# EAGLE design Enclosure 85x58 BHC (EAGLE 9.6.2)
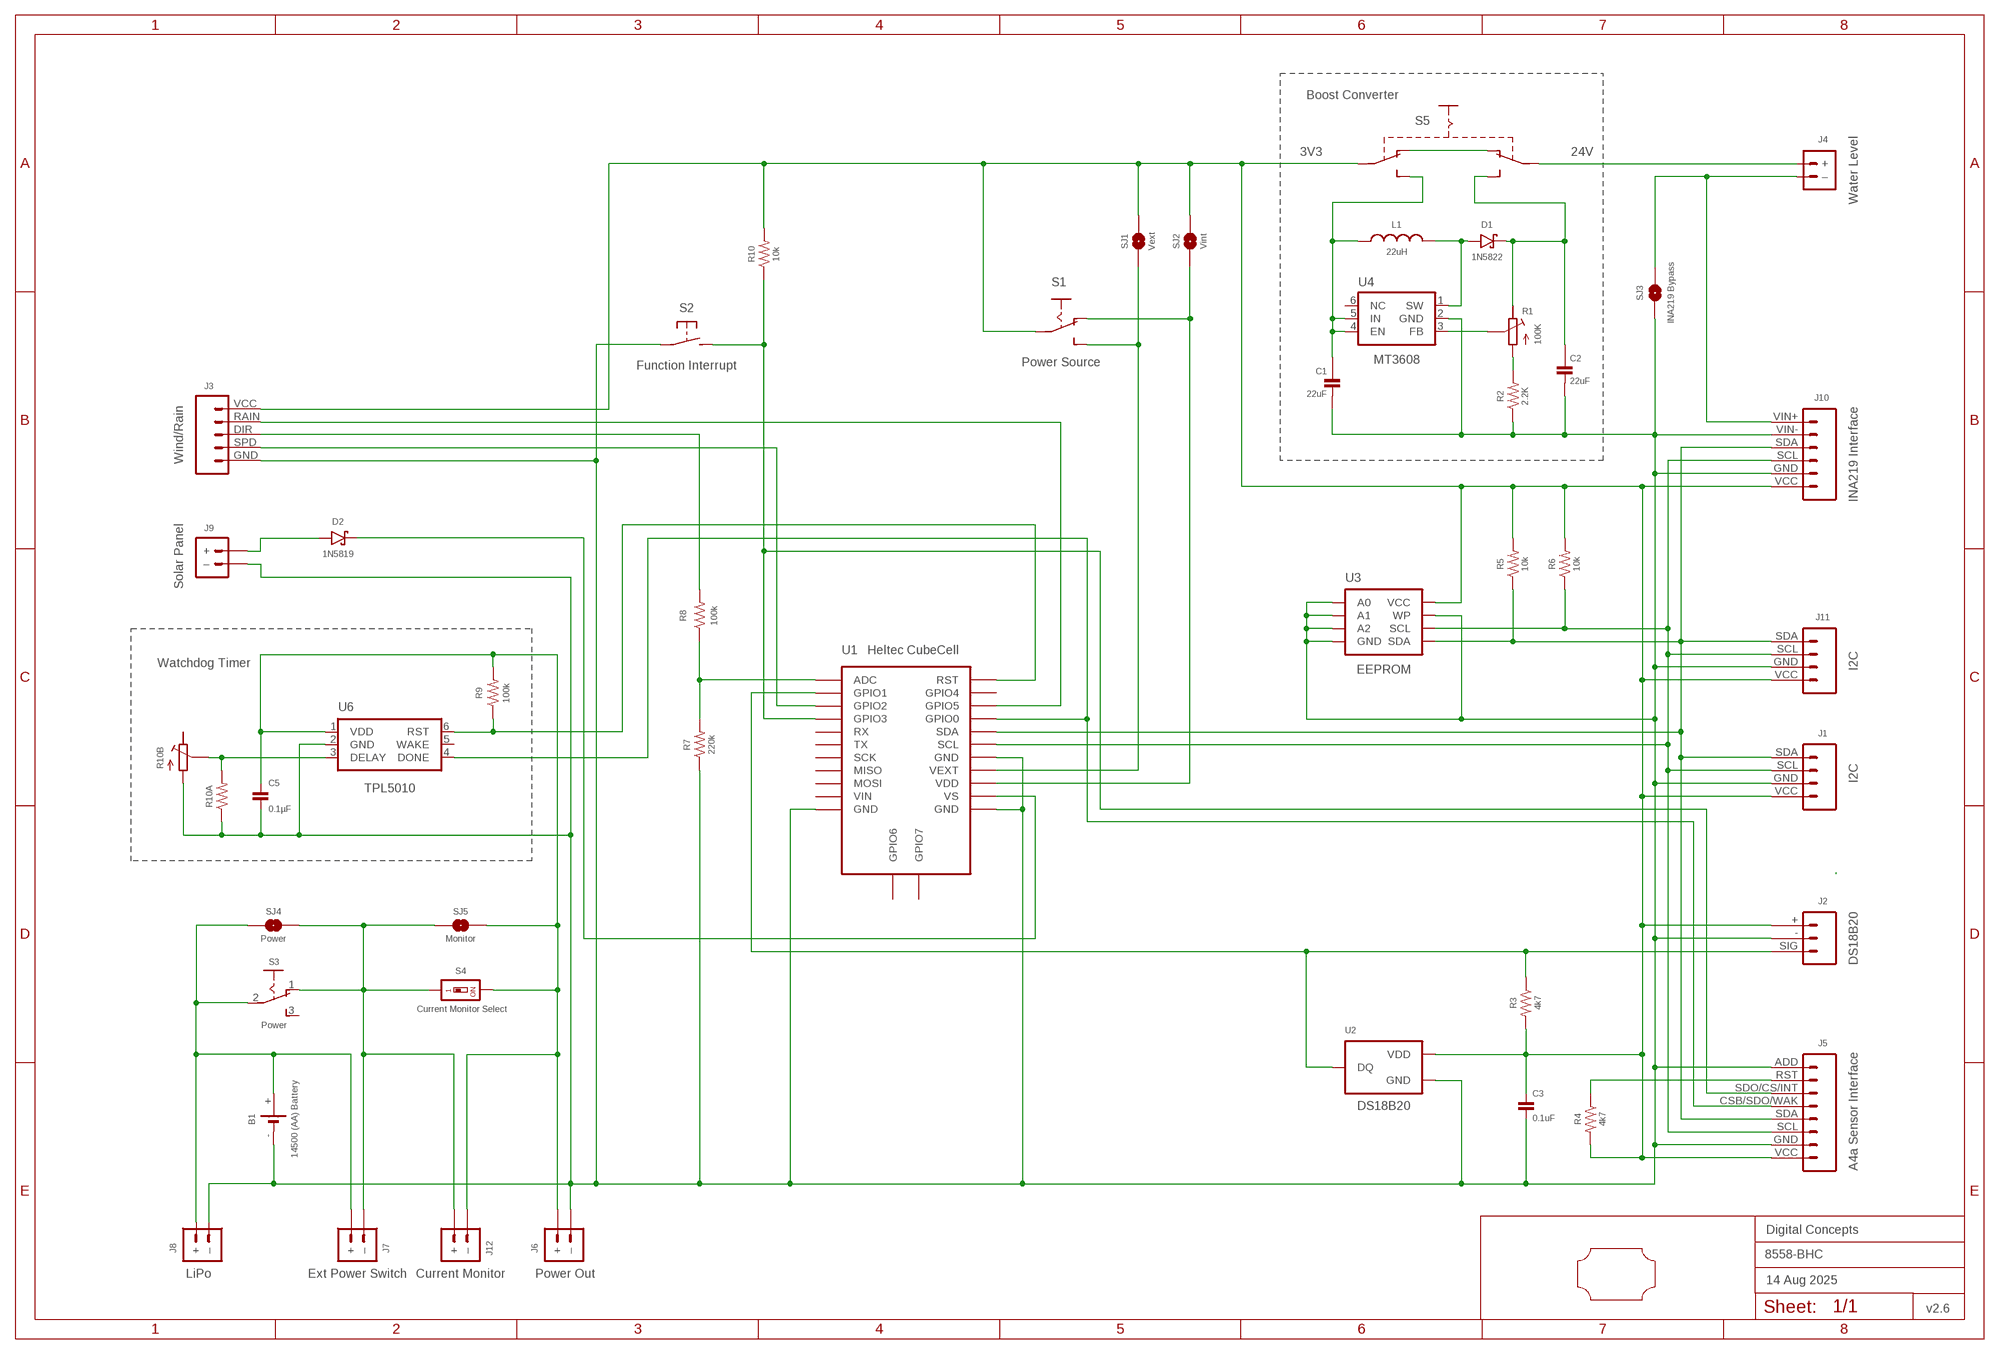
[diagram p0: schematic, sheet 1]
FRAME2 (A3L-LOC): DATE: 14 Aug 2025; OWNER: Digital Concepts; TITLE: 8558-BHC; VERSION: v2.6

## Parts
B1  14500 (AA) Battery  BATTERY-HOLDER-14500(AA)  [BATTERY-14500]
C1  22uF  CAPACITOR-1206  [C1206]
C2  22uF  CAPACITOR-1206  [C1206]
C3  0.1uF  CAPACITOR-0805  [C0805]
C5  0.1µF  CAPACITOR-0805  [C0805]
D1  1N5822  DIODE-SCHOTTKY-1N5822  [DIODE_SMB]
D2  1N5819  1N5819-SOD-123  [SOD-123]
J1  I2C  JST-PH2.0-4-VERTICAL-I2C  [JST-PH2.0-4-VERTICAL-I2C]
J2  DS18B20  JST-PH2.0-3-VERTICAL-DS18B20  [JST-PH2.0-3-VERTICAL]
J3  Wind/Rain  JST-PH2.0-5-VERTICAL-WEATHER  [JST-PH2.0-5-WEATHER]
J4  Water Level  JST-PH2.0-2-VERTICAL  [JST-PH2.0-2-VERTICAL=POWER]
J5  A4a Sensor Interface  HEADER-1X8-SENSOR  [CONN_08-SENSOR]
J6  Power Out  JST-GH1.25-2-HORIZONTAL-POWER  [JST-GH1.25-2-HORIZONTAL]
J7  Ext Power Switch  JST-PH2.0-2-DUAL-POWERJST-PTH-2  [JST-PH2.0-2-DUAL-POWER]
J8  LiPo  JST-PH2.0-2-MALE-HORIZONTALJST-PTH-2  [JST-PH2.0-2-HORIZONTAL]
J9  Solar Panel  JST-PH2.0-2-DUAL-POWERJST-PTH-2  [JST-PH2.0-2-DUAL-POWER]
J10  INA219 Interface  INA219-I2C-MODULE  [CONN_06-INA219]
J11  I2C  JST-PH2.0-4-HORIZONTAL-I2C  [JST-PH2.0-4-HORIZONTAL-I2C]
J12  Current Monitor  JST-PH2.0-2-HORIZONTAL-POWERJST-PTH-2  [JST-PH2.0-2-HORIZONTAL-POWER]
L1  22uH  INDUCTOR-CDRH104R/6D28L5038P  [CDRH104R+6D28]
R1  100K  RESISTOR-TRIMM-BAOTER-HORIZONTAL  [RTRIM64P]
R2  2.2K  RESISTORR0805  [R0805]
R3  4k7  RESISTORR0805  [R0805]
R4  4k7  RESISTORR0805  [R0805]
R5  10k  RESISTORR0805  [R0805]
R6  10k  RESISTORR0805  [R0805]
R7  220k  RESISTORR0805  [R0805]
R8  100k  RESISTORR0805  [R0805]
R9  100k  RESISTORR0805  [R0805]
R10  10k  RESISTORR0805  [R0805]
R10A  RESISTORR0805  [R0805]
R10B  RESISTOR-TRIMM-33  [RTRIM3*3]
S1  Power Source  SWITCH-SLIDE-SPDT-SMT  [SWITCH-SPDT-SMT]
S2  Function Interrupt  SWITCH-MOMENTARY-2-PIN  [SWITCH-2-PAD]
S3  Power  SWITCH-SLIDE-SPDT  [SWITCH-SLIDE-SPDT]
S4  Current Monitor Select  SWITCH-DIP-SWS001  [SMD-001]
S5  SWITCH-SLIDE-DPDT-PTH-S  [SWITCH-DPDT-PTH]
SJ1  Vext  SJ  [SJ]
SJ2  Vint  SJ-V-1  [SJ-VIA-1]
SJ3  INA219 Bypass  SJ  [SJ]
SJ4  Power  SJ  [SJ]
SJ5  Monitor  SJ  [SJ]
U1  Heltec CubeCell  HELTEC-CUBECELL  [HELTEC-CUBECELL]
U2  DS18B20  THERMOMETER-DS18B20  [TO-92]
U3  EEPROM  AT24CXX-EEPROM  [SOP-8]
U4  MT3608  [SOT-23-6@1]
U6  TPL5010  TPL5010DDCR  [SOT-23-6]
U$1  PCB-OUTLINE-C-85X58  [PROTO-28X18-OUTLINE-C]

## Nets
GND: B1.- C1.2 C2.2 C3.2 C5.2 J1.GND J2.- J3.GND J5.ADD J5.GND J6.-(–) J8.-(–) J9.-(–) J10.GND J10.VIN- J11.GND R2.1 R7.1 R10A.1 R10B.1(A) S2.P$1(P) SJ3.1 U1.GND@11(GND) U1.GND@14(GND) U1.GND@18(GND) U2.1(GND) U3.P$1(A0) U3.P$2(A1) U3.P$3(A2) U3.P$4(GND) U3.P$7(WP) U4.2(GND) U6.2(GND)
N$1: D2.A J9.+
N$2: J3.DIR R8.2
N$4: B1.+ J7.+ J8.+ S3.2(P) SJ4.2
N$5: D2.C U1.VS
N$6: D1.A L1.1 U4.1(SW)
N$7: S1.P$1(O) SJ2.2 U1.VDD
N$8: J1.SCL J5.SCL J10.SCL J11.SCL R6.1 U1.SCL U3.P$6(SCL)
N$9: J5.RST R4.1
N$10: R7.2 R8.1 U1.ADC
N$11: J1.SDA J5.SDA J10.SDA J11.SDA R5.1 U1.SDA U3.P$5(SDA)
N$12: J3.SPD U1.GPIO2
N$14: C5.1 J6.+ J12.-(–) R9.2 S4.2 SJ5.1 U6.1(VDD)
N$15: J4.-(–) J10.VIN+ SJ3.2
N$18: J2.SIG R3.1 U1.GPIO1 U2.2(DQ)
N$19: J5.SDO/CS/INT R10.1 S2.P$2(S) U1.GPIO3
N$20: C2.1 D1.C R1.3(E) S5.P$3(S1)
N$21: S1.P$2(S) SJ1.2 U1.VEXT
N$22: J3.RAIN U1.GPIO5
N$23: R1.1(A) R2.2
N$24: R1.2(S) U4.3(FB)
N$25: C1.1 L1.2 S5.P$6(S2) U4.4(EN) U4.5(IN)
N$26: S5.P$1(O1) S5.P$4(O2)
N$27: J4.+ S5.P$2(P1)
N$28: J5.CSB/SDO/WAK U1.GPIO0 U6.4(DONE)
N$36: R10A.2 R10B.2(S) U6.3(DELAY)
N$37: R9.1 U1.RST U6.6(RST)
N$39: J7.-(–) J12.+ S3.1(O) S4.1 SJ4.1 SJ5.2
VCC: C3.1 J1.VCC J2.+ J3.VCC J5.VCC J10.VCC J11.VCC R3.2 R4.2 R5.2 R6.2 R10.2 S1.COMMON(P) S5.P$5(P2) SJ1.1 SJ2.1 SJ2.1@V U2.3(VDD) U3.P$8(VCC)
Unconnected: R10B.3(E) S3.3(S) U1.GPIO4 U1.GPIO6 U1.GPIO7 U1.MISO U1.MOSI U1.RX U1.SCK U1.TX U1.VIN U4.6(NC) U6.5(WAKE)

## Notes on the sheet
- Boost Converter
- 3V3 | 24V
- Watchdog Timer

## Library data of the parts
B1 = digitalconcepts:BATTERY-HOLDER-14500(AA): 14500 (AA) battery holder
C1 C2 = digitalconcepts:CAPACITOR-1206: 1206 Capacitor
C3 C5 = digitalconcepts:CAPACITOR-0805: 0805 Capacitor
D1 = digitalconcepts:DIODE-SCHOTTKY-1N5822: 1N5822 Schottky Diode SMB
D2 = digitalconcepts:1N5819-SOD-123: 1N5819 Schottky Diode SOD-123
J1 = digitalconcepts:JST-PH2.0-4-VERTICAL-I2C: PH2.0 4P I2C Vertical Connector
J2 = digitalconcepts:JST-PH2.0-3-VERTICAL-DS18B20: DS18B20 PH2.0 Vertical PCB Connector
J3 = digitalconcepts:JST-PH2.0-5-VERTICAL-WEATHER: PH2.0 5P Vertical Weather Connector
J4 = digitalconcepts:JST-PH2.0-2-VERTICAL: PH2.0 2P PCB Connector
J5 = digitalconcepts:HEADER-1X8-SENSOR: IoT Sensors 1x8 Pin Header for 'Sandwich' IoT Sensors
J6 = digitalconcepts:JST-GH1.25-2-HORIZONTAL-POWER: JST GH1.25 2P PTH Connector (Power)
J7 J9 = digitalconcepts:JST-PH2.0-2-DUAL-POWER: JST PH2.0 2P PTH Dual-Side Connector (Power); PROD_ID: CONN-09863; SKU: PRT-09914
J8 = digitalconcepts:JST-PH2.0-2-MALE-HORIZONTAL: PH2.0 2P Right Angle PCB Connector; PROD_ID: CONN-09863; SKU: PRT-09914
J10 = digitalconcepts:INA219-I2C-MODULE: INA219 I2C Module
J11 = digitalconcepts:JST-PH2.0-4-HORIZONTAL-I2C: PH2.0 4P I2C Horizontal Connector
J12 = digitalconcepts:JST-PH2.0-2-HORIZONTAL-POWER: PH2.0 2P Right Angle PCB Connector; PROD_ID: CONN-09863; SKU: PRT-09914
L1 = digitalconcepts:INDUCTOR-CDRH104R/6D28: Inductor; SPICEPREFIX: L
R1 = digitalconcepts:RESISTOR-TRIMM-BAOTER-HORIZONTAL: Trimm Resistor - Horizontal BAOTER
R2-R10 R10A = digitalconcepts:RESISTOR: Resistor; SPICEPREFIX: R
R10B = digitalconcepts:RESISTOR-TRIMM-3*3: Trimm Resistor - 3*3 SMD
S1 = digitalconcepts:SWITCH-SLIDE-SPDT-SMT: Mini Sliding Switch SPDT SMT
S2 = digitalconcepts:SWITCH-MOMENTARY-2-PIN: 2 Pin Momentary Switch
S3 = digitalconcepts:SWITCH-SLIDE-SPDT: Mini Sliding Switch SPDT
S4 = digitalconcepts:SWITCH-DIP-SWS001: SMD Dip Switch 1 pol.
S5 = digitalconcepts:SWITCH-SLIDE-DPDT-PTH-S: Switch DPDT PTH-S
SJ1 SJ3-SJ5 = digitalconcepts:SJ: Solder Jumper
SJ2 = digitalconcepts:SJ-V-1: Solder Jumper with single Pad Via
U1 = digitalconcepts:HELTEC-CUBECELL: Heltec CubeCell Development Board
U2 = digitalconcepts:THERMOMETER-DS18B20: Digital Thermometer -55C-125C TO92-3; AVAILABILITY: Bad; DESCRIPTION: Temperature Sensor Digital, Local -55°C ~ 125°C 12 b 8-uMAX; MF: Maxim Integrated; MP: DS18B20; PACKAGE: TO-92 Maxim Integrated; PRICE: None
U3 = digitalconcepts:AT24CXX-EEPROM: AT24Cxx EEPROM SOP-8
U4 = digitalconcepts:MT3608: MT3608 DC-DC Step-Up Voltage Converter
U6 = digitalconcepts:TPL5010DDCR: TPL5010 Nano-Power System Timer with Watchdog
U$1 = digitalconcepts:PCB-OUTLINE-C-85X58: PCB outline with cut-out for 85 x 58 enclosure

## Board
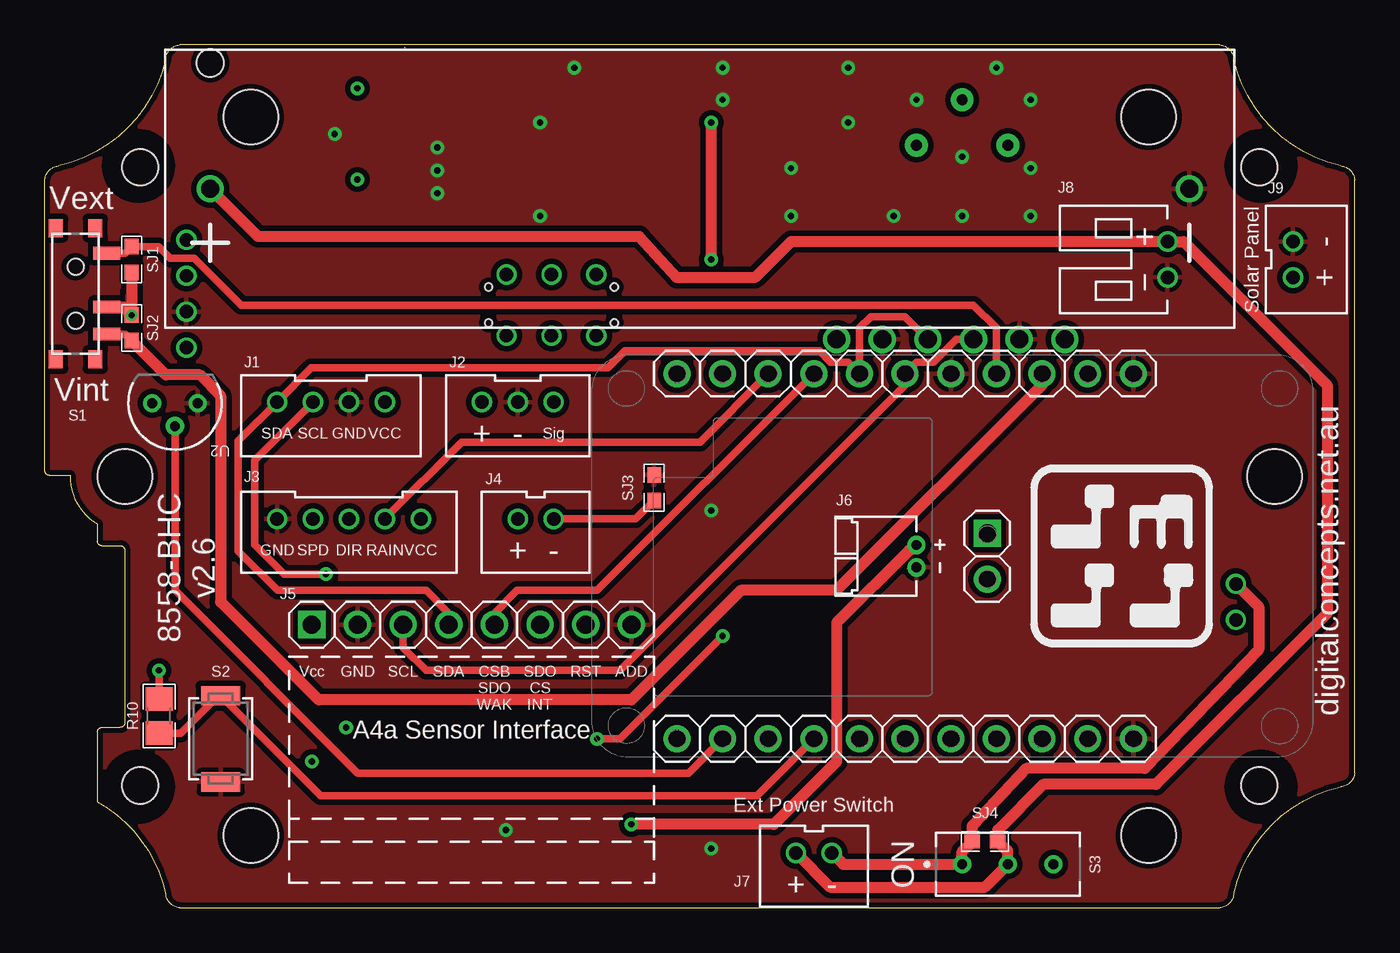
[diagram p1: board, top side]
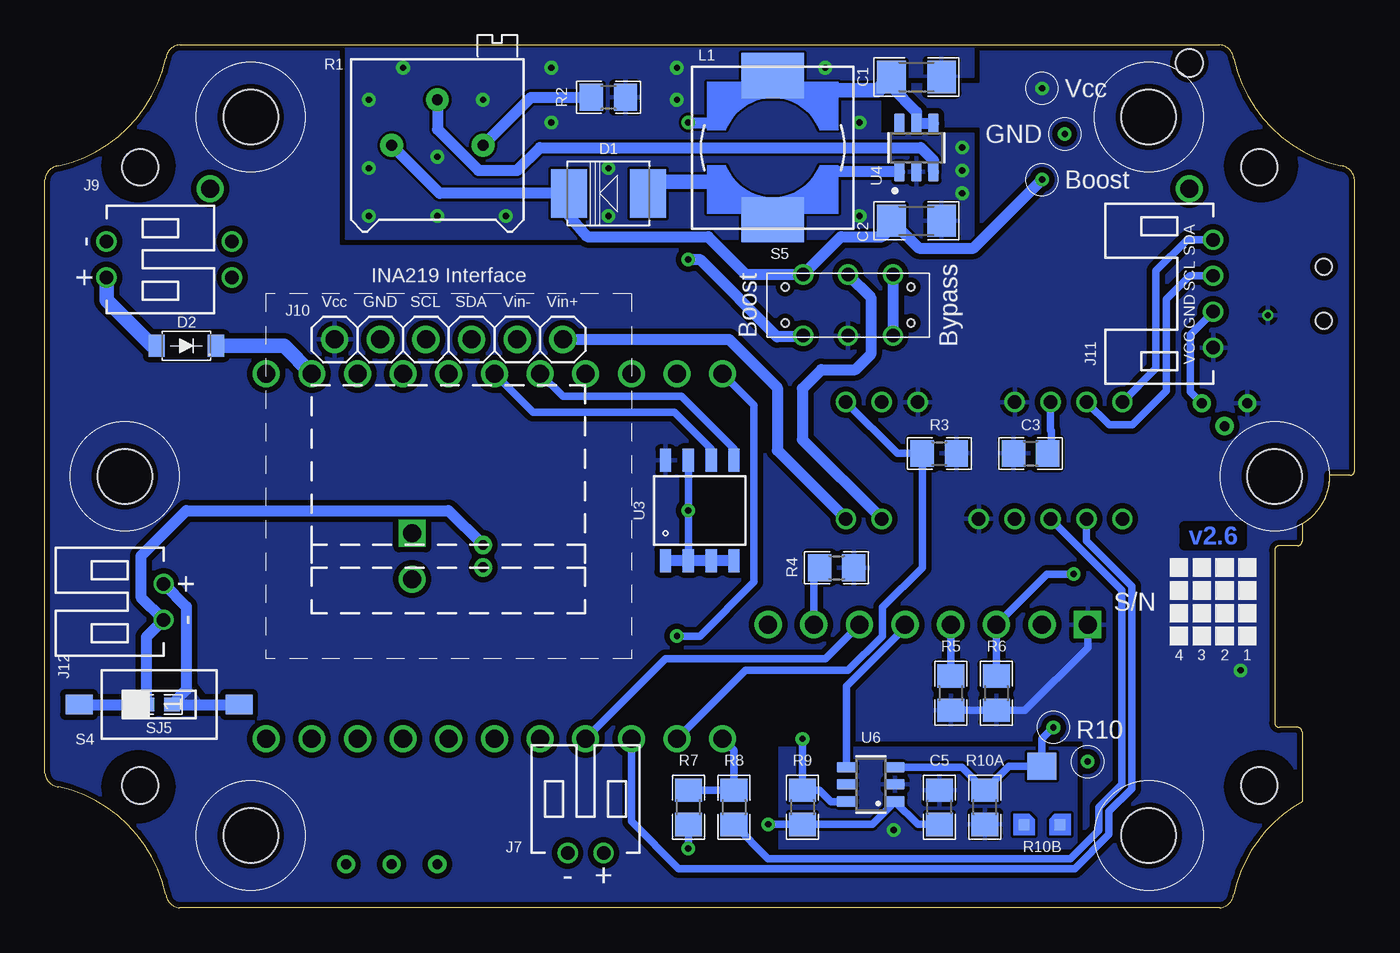
[diagram p2: board, bottom side, seen from below]

Size 72.9 x 48.01 mm. Coordinates in mm from the lower left corner, seen from the top.
Copper layers (1*16): Top 0.035mm / dielectric 1.5mm / Bottom 0.035mm
Design rules "default *": minimum track width 6mil, minimum drill 0.35mm, track to track 6mil, track to pad 6mil, pad to pad 6mil, via to via 6mil, smd to smd 6mil, copper to edge 6mil, drill to drill 6mil, minimum pad ring 1mil, minimum via ring 8mil, stop-mask expansion 4mil, vias tented up to drill 0mil, thermal gap 10mil

### Footprints (pad centres in the part's own frame; a part is rotated, then mirrored left to right if it is on the bottom)
BATTERY-14500 = drill 1: + -27.25,0; - 27.25,0 | hole 1.524: -27.25,7
C1206 = smd 1.6 x 1.8: 1 -1.4,0; 2 1.4,0
C0805 = smd 1.3 x 1.5: 1 -0.95,0; 2 0.95,0
DIODE_SMB = smd 2 x 2.7: A 2.2,0; C -2.2,0
SOD-123 = smd 0.91 x 1.22: A -1.65,0; C 1.65,0
JST-PH2.0-4-VERTICAL-I2C = drill 0.75: GND 1,0; SCL -1,0; SDA -3,0; VCC 3,0
JST-PH2.0-3-VERTICAL = drill 0.75: + -2,0; - 0,0; SIG 2,0
JST-PH2.0-5-WEATHER = drill 0.75: DIR 0,0; GND 4,0; RAIN -2,0; SPD 2,0; VCC -4,0
JST-PH2.0-2-VERTICAL=POWER = drill 0.75: + -1,0; - 1,0
CONN_08-SENSOR = drill 1 pad 1.524: ADD 17.78,0; CSB/SDO/WAK 10.16,0; GND 2.54,0; RST 15.24,0; SCL 5.08,0; SDA 7.62,0; SDO/CS/INT 12.7,0 | drill 1 pad 1.524 square: VCC 0,0
JST-GH1.25-2-HORIZONTAL = drill 0.55 pad 1.016: + -0.625,0; - 0.625,0
JST-PH2.0-2-DUAL-POWER = drill 0.75: + 1,0; - -1,0
JST-PH2.0-2-HORIZONTAL = drill 0.75: + 1,0; - -1,0
CONN_06-INA219 = drill 1 pad 1.524: GND 2.54,0; SCL 5.08,0; SDA 7.62,0; VCC 0,0; VIN+ 12.7,0; VIN- 10.16,0
JST-PH2.0-4-HORIZONTAL-I2C = drill 0.75: GND -1,0; SCL 1,0; SDA 3,0; VCC -3,0
JST-PH2.0-2-HORIZONTAL-POWER = drill 0.75: + 1,0; - -1,0
CDRH104R+6D28 = smd 2.5 x 3.5: 1 -4,0; 2 4,0
RTRIM64P = drill 0.61 pad 1.27: 1 0,-2.54; 2 2.54,0; 3 0,2.54
R0805 = smd 1.3 x 1.5: 1 -0.95,0; 2 0.95,0
RTRIM3*3 = smd 0.6 x 0.6: 1 -1,-1.6; 3 1,-1.6 | smd 1.6 x 1.5: 2 0,1.65
SWITCH-SPDT-SMT = smd 0.7 x 1.5: COMMON 0.75,1.75; P$1 2.25,1.75; P$2 -2.25,1.75 | smd 1 x 0.8: GND@1 3.65,-1.1; GND@2 3.65,1.1; GND@3 -3.65,1.1; GND@4 -3.65,-1.1 | hole 0.9: -1.5,0; 1.5,0
SWITCH-2-PAD = smd 1.067 x 2.184: P$1 -2.4,0; P$2 2.4,0
SWITCH-SLIDE-SPDT = drill 0.55 pad 1.016: 1 -2.54,0; 2 0,0; 3 2.54,0
SMD-001 = smd 1.1 x 1.5: 1 0,-4.45; 2 0,4.45
SWITCH-DPDT-PTH = drill 0.75: P$1 -1.7,2.5; P$2 -1.7,0; P$3 -1.7,-2.5; P$4 1.7,2.5; P$5 1.7,0; P$6 1.7,-2.5 | hole 0.42: 1,3.5; -1,3.5; 1,-3.5; -1,-3.5
SJ = smd 0.864 x 0.762: 1 -0.711,0; 2 0.711,0
SJ-VIA-1 = smd 0.864 x 0.762: 1 -0.711,0; 2 0.711,0 | drill 0.35 pad 0.61: 1@V -0.711,0
HELTEC-CUBECELL = drill 1: ADC 0,0; GND@11 0,25.4; GND@14 -20.32,25.4; GND@18 -20.32,15.24; GPIO0 -20.32,7.62; GPIO1 0,2.54; GPIO2 0,5.08; GPIO3 0,7.62; GPIO4 -20.32,2.54; GPIO5 -20.32,5.08; GPIO6 -8.89,17.272; MISO 0,17.78; MOSI 0,20.32; RST -20.32,0; RX 0,10.16; SCK 0,15.24; SCL -20.32,12.7; SDA -20.32,10.16; TX 0,12.7; VDD -20.32,20.32; VEXT -20.32,17.78; VIN 0,22.86; VS -20.32,22.86 | drill 1 square: GPIO7 -11.43,17.272
TO-92 = drill 0.55 pad 1.016: 1 -1.27,0; 2 0,1.27; 3 1.27,0
SOP-8 = smd 0.635 x 1.27: P$1 -1.905,-2.794; P$2 -0.635,-2.794; P$3 0.635,-2.794; P$4 1.905,-2.794; P$5 1.905,2.794; P$6 0.635,2.794; P$7 -0.635,2.794; P$8 -1.905,2.794
SOT-23-6@1 = smd 1.1 x 0.6: 1 -1.35,0.95; 2 -1.35,0; 3 -1.35,-0.95; 4 1.35,-0.95; 5 1.35,0; 6 1.35,0.95
SOT-23-6 = smd 1.1 x 0.6: 1 -1.35,0.95; 2 -1.35,0; 3 -1.35,-0.95; 4 1.35,-0.95; 5 1.35,0; 6 1.35,0.95
PROTO-28X18-OUTLINE-C = hole 2.032: -31.14,17.196; -31.14,-17.196; 31.14,-17.196; 31.14,17.196 | hole 3.048: -24.994,19.99; -32.004,0; -24.994,-19.99; 24.994,-19.99; 32.004,0; 24.994,19.99

### Placement (x,y rotation side)
B1  36.45,40.01 0 top
C1  24.38,46.23 0 bottom
C2  24.38,38.23 0 bottom
C3  18.03,25.27 0 bottom
C5  23.11,5.59 90 bottom
D1  41.53,39.75 0 bottom
D2  65.02,31.27 0 bottom
J1  15.92,28.13 0 top
J2  26.32,28.13 0 top
J3  16.92,21.63 180 top
J4  27.32,21.63 0 top
J5  14.86,15.75 0 top
J6  48.51,19.56 270 top
J7  42.8,3.05 0 bottom
J8  62.48,36.07 90 top
J9  69.47,36.07 270 bottom
J10  56.77,31.62 0 bottom
J11  7.87,34.16 90 bottom
J12  66.29,17.02 90 bottom
L1  32.38,42.29 90 bottom
R1  51.05,42.42 90 bottom
R2  41.53,45.09 180 bottom
R3  23.11,25.27 0 bottom
R4  28.83,18.92 0 bottom
R5  22.48,11.94 270 bottom
R6  19.94,11.94 270 bottom
R7  37.08,5.59 90 bottom
R8  34.54,5.59 270 bottom
R9  30.73,5.59 270 bottom
R10  6.35,10.67 90 top
R10A  20.57,5.59 90 bottom
R10B  17.4,6.22 0 bottom
S1  1.7,34.16 270 top
S2  9.78,9.4 90 top
S3  53.59,2.41 0 top
S4  66.55,11.3 90 bottom
S5  28.19,33.53 270 bottom
SJ1  4.83,36.07 90 top
SJ2  4.83,32.26 270 top
SJ3  33.91,23.37 270 top
SJ4  52.32,3.68 0 top
SJ5  66.55,11.3 0 bottom
U1  35.18,9.4 270 top
U2  7.24,28.07 180 top
U3  36.45,22.1 0 bottom
U4  24.38,42.29 90 bottom
U6  26.92,6.86 180 bottom
U$1  36.45,24 0 top

### Tracks (layer width: path | path; a pad name or v marks a point on that pad's centre or on a via)
$X1
  cutout Bottom: 67.69,43.31 arc180 67.69,39.24 arc180
$X2
  cutout Bottom: 67.69,8.76 arc180 67.69,4.7 arc180
$X3
  cutout Bottom: 5.21,8.76 arc180 5.21,4.7 arc180
$X4
  cutout Bottom: 5.21,43.31 arc180 5.21,39.24 arc180
$X5
  cutout Top: 5.21,43.31 arc180 5.21,39.24 arc180
$X6
  cutout Top: 67.69,43.31 arc180 67.69,39.24 arc180
$X7
  cutout Top: 67.69,8.76 arc180 67.69,4.7 arc180
$X8
  cutout Top: 5.21,8.76 arc180 5.21,4.7 arc180
GND  (via drill 0.35)
  Bottom 0.406: C3.2 16.89,25.47 16.89,26.54 16.92,26.57 J1.GND | R7.1 v37.08,3.3 | U3.P$7 v37.08,22.1 U3.P$2 | J11.GND 9.14,31.89 9.14,28.7 U2.1
  Bottom 0.61: U3.P$4 U3.P$3 U3.P$2 U3.P$1
  other vias: 21.84,42.29 27.56,43.69 37.72,44.96 37.72,46.74 44.7,46.74 44.7,43.69 41.53,38.48 47.24,38.48 51.05,38.48 51.05,41.78 54.86,38.48 54.86,41.15 52.96,46.74 21.84,39.75 48.51,44.96 54.86,44.96 27.56,38.48 41.53,41.15 16.13,43.05 21.84,41.02 29.46,46.74 25.65,4.32
  pour Top (isolate 0.305, rank 2): -2.08,49.93 -2.08,-1.97 74.92,-1.97 74.92,49.93
  pour Bottom (rank 2): 21.21,48.13 21.21,46.23 26.42,46.23 26.42,43.05 21.21,43.05 21.21,37.21 56.13,37.21 56.13,48.13
  pour Bottom: 32,8.89 15.49,8.89 15.49,3.3 32,3.3
GND1  (via drill 0.35)
  other vias: 14.86,8.13
N$1
  Bottom 0.813: D2.A 66.94,31.27 69.47,33.8 J9.+
N$2
  Bottom 0.406: J3.DIR 12.95,17.67 12.95,6.86 14.22,5.59 14.22,4.32 15.81,2.73 32.64,2.73 R8.2
N$4
  Top 0.61: B1.+ 11.87,37.34 33.09,37.34 35.18,35.05 39.51,35.05 41.53,37.07 J8.+ 63.39,37.07 71.37,29.08 71.37,16.38 61.85,6.86 55.58,6.86 53.03,4.32 SJ4.2 53.52,3.19 53.59,3.18 S3.2 52.32,1.14 43.7,1.14 J7.+
N$5
  Bottom 0.813: D2.C 59.59,31.27 U1.VS
N$6
  Bottom 0.61: L1.1 31.75,38.29 29.1,40.94 U4.1
  Bottom 0.813: D1.A 38.69,40.39 35.17,40.39 33.08,38.29 L1.1
N$7
  Top 0.406: SJ2.2 4.46,31.91 S1.P$1
  Top 0.61: SJ2.2 6.73,29.64 8.64,29.64 9.78,28.5 9.78,17.02 15.24,11.56 32.64,11.56 38.73,17.65 44.07,17.65 55.5,29.08 U1.VDD
N$8  (via drill 0.35)
  Top 0.406: J5.SCL 19.94,14.48 21.21,13.21 32,13.21 47.88,29.08 U1.SCL 48.51,30.35 49.47,30.35 50.74,31.62 J10.SCL | v15.64,18.57 13.31,18.57 11.68,20.19 11.68,24.9 J1.SCL
  Bottom 0.406: v15.64,18.57 17.12,18.57 J5.SCL R6.1 | U3.P$6 35.81,25.53 37.85,27.56 45.72,27.56 U1.SCL | J11.SCL 9.16,35.16 10.47,33.85 10.47,28.77 12.38,26.86 13.65,26.86 J1.SCL
N$9
  Bottom 0.406: R4.1 30.1,18.6 J5.RST
N$10
  Bottom 0.406: R7.2 R8.1 34.54,8.76 U1.ADC
N$11
  Top 0.406: J10.SDA 47.88,32.89 45.97,32.89 45.34,32.26 U1.SDA 44.7,30.35 43.74,30.35 43.1,30.99 32.28,30.99 31.33,30.04 14.82,30.04 J1.SDA 10.77,25.98 10.77,19.84 12.95,17.65 21.21,17.65 22.48,16.38 J5.SDA
  Bottom 0.406: J11.SDA 9.32,37.16 11.05,35.43 11.05,30 J1.SDA | U1.SDA 44.07,28.45 37.46,28.45 34.54,25.53 U3.P$5 | J5.SDA R5.1
N$12
  Bottom 0.406: J3.SPD 14.92,20.42 12.39,17.9 12.39,6.63 13.66,5.36 13.66,4.09 15.58,2.17 37.63,2.17 40.26,4.8 U1.GPIO2
N$14  (via drill 0.35)
  Top 0.61: J6.+ 48.23,19.9 48.11,19.9 44.07,15.85 44.07,8.13 40.58,4.64 v32.64,4.64
  Bottom 0.406: C5.1 24.3,4.64 U6.1 26.84,4.64 R9.2 v32.64,4.64
  Bottom 0.61: S4.2 SJ5.1 67.26,15.05 J12.- 67.56,17.29 67.56,19.56 65.02,22.1 50.43,22.1 J6.+
N$15
  Top 0.406: J4.- 32.88,21.63 SJ3.2
  Bottom 0.61: J4.- 32.13,25.44 32.13,28.94 34.81,31.62 J10.VIN+
N$18
  Top 0.406: U1.GPIO1 35.81,7.49 17.4,7.49 7.24,17.65 U2.2
  Bottom 0.406: J2.SIG 25.46,25.27 R3.1 24.06,18.93 26.29,16.71 26.29,15.11 28.19,13.21 33.91,13.21 U1.GPIO1
N$19
  Top 0.406: R10.1 7.56,9.72 9.64,11.8 S2.P$2 15.35,6.22 39.62,6.22 U1.GPIO3
  Bottom 0.406: U1.GPIO3 38.35,13.84 29.46,13.84 J5.SDO/CS/INT
N$20  (via drill 0.35)
  Bottom 0.61: v17.4,40.51 21.21,36.7 24.26,36.7 C2.1 25.78,37.84 26.29,37.34 28.58,37.34 S5.P$3 33.87,35.23 35.98,37.34 42.71,37.34 43.73,38.51 D1.C 50.93,39.75 R1.3
N$21
  Top 0.406: U1.VEXT 52.96,32.26 51.69,33.53 10.92,33.53 8.31,36.14 6.96,36.14 6.34,36.78 SJ1.2 4.46,36.41 S1.P$2
N$22
  Top 0.406: J3.RAIN 23.19,25.91 36.45,25.91 U1.GPIO5
N$23
  Bottom 0.61: R1.1 45.85,45.09 R2.2
N$24
  Bottom 0.61: R1.2 51.05,43.31 48.77,41.02 46.61,41.02 45.34,42.29 24.15,42.29 23.43,41.58 U4.3
N$25  (via drill 0.35)
  Top 0.61: v37.08,43.69 v37.08,36.07
  Bottom 0.61: C1.1 25.78,45.67 24.38,44.27 U4.5 U4.4 | v37.08,43.69 35.81,43.69 33.21,46.29 L1.2 | 30.69,31.76 32.14,31.76 36.45,36.07 v37.08,36.07
  Bottom 0.813: C1.1 26.53,45.48 31.58,45.48 L1.2 | S5.P$6 30.69,31.76
N$26
  Bottom 0.61: S5.P$1 S5.P$4
N$27
  Bottom 0.61: J4.+ 30.73,26.05 30.73,28.88 29.68,29.93 27.77,29.93 26.92,30.78 26.92,33.96 S5.P$2
N$28
  Top 0.406: U1.GPIO0 30.73,17.65 26.29,17.65 25.02,16.38 J5.CSB/SDO/WAK
  Bottom 0.406: J5.CSB/SDO/WAK 25.02,15.59 28.27,12.33 U6.4
N$36  (via drill 0.35)
  Bottom 0.406: U6.3 21.84,7.81 R10A.2 19.24,7.87 R10B.2 17.4,9.4 v16.76,10.03
N$37  (via drill 0.35)
  Top 0.406: v37.72,15.11 32,9.4 v30.73,9.4
  Bottom 0.406: U6.6 29.15,5.91 29.78,6.54 R9.1 v30.73,9.4 | U1.RST 33.42,27.96 33.42,18.14 36.45,15.11 v37.72,15.11
N$39
  Top 0.61: J12.+ 67.56,16.75 67.56,14.35 61.21,7.75 54.62,7.75 51.61,4.55 SJ4.1 51.05,3.12 S3.1 44.43,2.41 J7.-
  Bottom 0.61: J12.+ 65.02,16.75 65.02,12.12 SJ5.2 S4.1
  pour Bottom: 65.85,11.3 65.02,12.12 64.39,11.3
VCC  (via drill 0.35)
  Top 0.406: R10.2 v6.35,13.21
  Top 0.61: S1.COMMON 4.38,33.41 SJ2.1@V SJ1.1
  Bottom 0.406: R5.2 R6.2 18.35,10.99 14.86,14.48 J5.VCC
  other vias: 17.4,45.59
  pour Bottom (isolate 0.305, rank 5): -1.08,48.93 -1.08,-0.97 73.92,-0.97 73.92,48.93
  pour Top: 4.22,33.46 4.7,33.93 4.7,32.98

### Text on the board
Bottom: v2.6
tPlace: digitalconcepts.net.au | 8558-BHC / v2.6
bPlace: Vin+ | Vin- | SDA | SCL | GND | Vcc | S/N | 1 | 2 | 3 | 4
tNames: Vext | Solar Panel | Vint | Vcc | GND | SCL | SDA | RST | ADD | CSB / SDO / WAK | SDO / CS / INT | ON
bNames: Vcc | GND | Boost | J9 | Bypass | Boost | R10 | J7